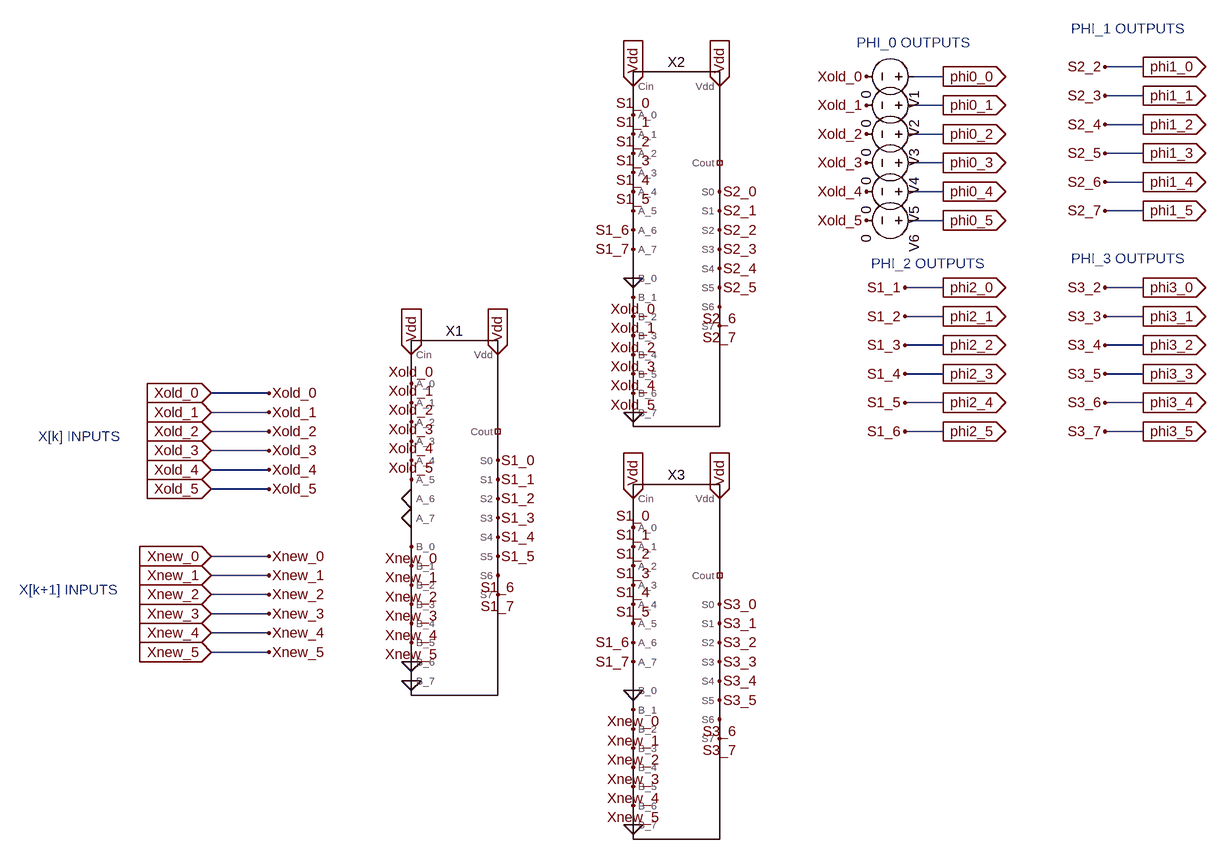
[diagram p0: schematic Draft1.asc]
Draft1.asc, the LTspice schematic file:
Version 4
SHEET 1 2044 796
WIRE 1904 -528 1840 -528
WIRE 1392 -512 1344 -512
WIRE 1904 -480 1840 -480
WIRE 1392 -464 1344 -464
WIRE 1904 -432 1840 -432
WIRE 1392 -416 1344 -416
WIRE 1904 -384 1840 -384
WIRE 1392 -368 1344 -368
WIRE 1904 -336 1840 -336
WIRE 1392 -320 1344 -320
WIRE 1904 -288 1840 -288
WIRE 1392 -272 1344 -272
WIRE 1392 -160 1328 -160
WIRE 1904 -160 1840 -160
WIRE 1392 -112 1328 -112
WIRE 1904 -112 1840 -112
WIRE 1392 -64 1328 -64
WIRE 1904 -64 1840 -64
WIRE 1392 -16 1328 -16
WIRE 1904 -16 1840 -16
WIRE -1392 16 -1488 16
WIRE 1392 32 1328 32
WIRE 1904 32 1840 32
WIRE -1392 48 -1488 48
WIRE -1392 80 -1488 80
WIRE 1392 80 1328 80
WIRE 1904 80 1840 80
WIRE -1392 112 -1488 112
WIRE -1392 144 -1488 144
WIRE -1392 176 -1488 176
WIRE -1392 288 -1488 288
WIRE -1392 320 -1488 320
WIRE -1392 352 -1488 352
WIRE -1392 384 -1488 384
WIRE -1392 416 -1488 416
WIRE -1392 448 -1488 448
FLAG -1488 16 Xold_0
IOPIN -1488 16 In
FLAG -1488 48 Xold_1
IOPIN -1488 48 In
FLAG -1488 80 Xold_2
IOPIN -1488 80 In
FLAG -1488 112 Xold_3
IOPIN -1488 112 In
FLAG -1488 144 Xold_4
IOPIN -1488 144 In
FLAG -1488 176 Xold_5
IOPIN -1488 176 In
FLAG -1488 288 Xnew_0
IOPIN -1488 288 In
FLAG -1488 320 Xnew_1
IOPIN -1488 320 In
FLAG -1488 352 Xnew_2
IOPIN -1488 352 In
FLAG -1488 384 Xnew_3
IOPIN -1488 384 In
FLAG -1488 416 Xnew_4
IOPIN -1488 416 In
FLAG -1488 448 Xnew_5
IOPIN -1488 448 In
FLAG -512 128 S1_0
FLAG -512 160 S1_1
FLAG -512 192 S1_2
FLAG -512 224 S1_3
FLAG -512 256 S1_4
FLAG -512 288 S1_5
FLAG -512 320 S1_6
FLAG -512 352 S1_7
FLAG 352 -144 Xold_0
FLAG 352 -112 Xold_1
FLAG 352 -80 Xold_2
FLAG 352 -48 Xold_3
FLAG 352 -16 Xold_4
FLAG 352 16 Xold_5
FLAG 352 544 Xnew_0
FLAG 352 576 Xnew_1
FLAG 352 608 Xnew_2
FLAG 352 640 Xnew_3
FLAG 352 672 Xnew_4
FLAG 352 704 Xnew_5
FLAG -656 192 0
FLAG -656 224 0
FLAG -656 464 0
FLAG -656 496 0
FLAG 352 48 0
FLAG 352 -176 0
FLAG 352 736 0
FLAG 352 512 0
FLAG 1392 -512 phi0_0
IOPIN 1392 -512 Out
FLAG 1392 -464 phi0_1
IOPIN 1392 -464 Out
FLAG 1392 -416 phi0_2
IOPIN 1392 -416 Out
FLAG 1392 -368 phi0_3
IOPIN 1392 -368 Out
FLAG 1392 -320 phi0_4
IOPIN 1392 -320 Out
FLAG 1392 -272 phi0_5
IOPIN 1392 -272 Out
FLAG 1904 -528 phi1_0
IOPIN 1904 -528 Out
FLAG 1904 -480 phi1_1
IOPIN 1904 -480 Out
FLAG 1904 -432 phi1_2
IOPIN 1904 -432 Out
FLAG 1904 -384 phi1_3
IOPIN 1904 -384 Out
FLAG 1904 -336 phi1_4
IOPIN 1904 -336 Out
FLAG 1904 -288 phi1_5
IOPIN 1904 -288 Out
FLAG 1904 -160 phi3_0
IOPIN 1904 -160 Out
FLAG 1904 -112 phi3_1
IOPIN 1904 -112 Out
FLAG 1904 -64 phi3_2
IOPIN 1904 -64 Out
FLAG 1904 -16 phi3_3
IOPIN 1904 -16 Out
FLAG 1904 32 phi3_4
IOPIN 1904 32 Out
FLAG 1904 80 phi3_5
IOPIN 1904 80 Out
FLAG 1392 -160 phi2_0
IOPIN 1392 -160 Out
FLAG 1392 -112 phi2_1
IOPIN 1392 -112 Out
FLAG 1392 -64 phi2_2
IOPIN 1392 -64 Out
FLAG 1392 -16 phi2_3
IOPIN 1392 -16 Out
FLAG 1392 32 phi2_4
IOPIN 1392 32 Out
FLAG 1392 80 phi2_5
IOPIN 1392 80 Out
FLAG 1264 -512 Xold_0
FLAG 1264 -464 Xold_1
FLAG 1264 -416 Xold_2
FLAG 1264 -368 Xold_3
FLAG 1264 -320 Xold_4
FLAG 1264 -272 Xold_5
FLAG 1328 -160 S1_1
FLAG 1328 -112 S1_2
FLAG 1328 -64 S1_3
FLAG 1328 -16 S1_4
FLAG 1328 32 S1_5
FLAG 1328 80 S1_6
FLAG 496 -320 S2_0
FLAG 496 -288 S2_1
FLAG 496 -256 S2_2
FLAG 496 -224 S2_3
FLAG 496 -192 S2_4
FLAG 496 -160 S2_5
FLAG 496 -128 S2_6
FLAG 496 -96 S2_7
FLAG 496 368 S3_0
FLAG 496 400 S3_1
FLAG 496 432 S3_2
FLAG 496 464 S3_3
FLAG 496 496 S3_4
FLAG 496 528 S3_5
FLAG 496 560 S3_6
FLAG 496 592 S3_7
FLAG 1840 -528 S2_2
FLAG 1840 -480 S2_3
FLAG 1840 -432 S2_4
FLAG 1840 -384 S2_5
FLAG 1840 -336 S2_6
FLAG 1840 -288 S2_7
FLAG 1840 -160 S3_2
FLAG 1840 -112 S3_3
FLAG 1840 -64 S3_4
FLAG 1840 -16 S3_5
FLAG 1840 32 S3_6
FLAG 1840 80 S3_7
FLAG 352 -448 S1_0
FLAG 352 -416 S1_1
FLAG 352 -384 S1_2
FLAG 352 -352 S1_3
FLAG 352 -320 S1_4
FLAG 352 -288 S1_5
FLAG 352 -256 S1_6
FLAG 352 -224 S1_7
FLAG 352 240 S1_0
FLAG 352 272 S1_1
FLAG 352 304 S1_2
FLAG 352 336 S1_3
FLAG 352 368 S1_4
FLAG 352 400 S1_5
FLAG 352 432 S1_6
FLAG 352 464 S1_7
FLAG -656 -48 Vdd
IOPIN -656 -48 In
FLAG -512 -48 Vdd
IOPIN -512 -48 In
FLAG 352 192 Vdd
IOPIN 352 192 In
FLAG 496 192 Vdd
IOPIN 496 192 In
FLAG 352 -496 Vdd
IOPIN 352 -496 In
FLAG 496 -496 Vdd
IOPIN 496 -496 In
FLAG -1392 16 Xold_0
FLAG -1392 80 Xold_2
FLAG -1392 112 Xold_3
FLAG -1392 144 Xold_4
FLAG -1392 176 Xold_5
FLAG -1392 288 Xnew_0
FLAG -1392 320 Xnew_1
FLAG -1392 352 Xnew_2
FLAG -1392 384 Xnew_3
FLAG -1392 416 Xnew_4
FLAG -1392 448 Xnew_5
FLAG -1392 48 Xold_1
FLAG -656 0 Xold_0
FLAG -656 64 Xold_2
FLAG -656 96 Xold_3
FLAG -656 128 Xold_4
FLAG -656 160 Xold_5
FLAG -656 32 Xold_1
FLAG -656 272 Xnew_0
FLAG -656 304 Xnew_1
FLAG -656 336 Xnew_2
FLAG -656 368 Xnew_3
FLAG -656 400 Xnew_4
FLAG -656 432 Xnew_5
SYMBOL voltage 1360 -512 R90
WINDOW 123 0 0 Left 0
WINDOW 39 0 0 Left 0
SYMATTR InstName V1
SYMATTR Value 0
SYMBOL voltage 1360 -464 R90
WINDOW 123 0 0 Left 0
WINDOW 39 0 0 Left 0
SYMATTR InstName V2
SYMATTR Value 0
SYMBOL voltage 1360 -416 R90
WINDOW 123 0 0 Left 0
WINDOW 39 0 0 Left 0
SYMATTR InstName V3
SYMATTR Value 0
SYMBOL voltage 1360 -368 R90
WINDOW 123 0 0 Left 0
WINDOW 39 0 0 Left 0
SYMATTR InstName V4
SYMATTR Value 0
SYMBOL voltage 1360 -320 R90
WINDOW 123 0 0 Left 0
WINDOW 39 0 0 Left 0
SYMATTR InstName V5
SYMATTR Value 0
SYMBOL voltage 1360 -272 R90
WINDOW 123 0 0 Left 0
WINDOW 39 0 0 Left 0
SYMATTR InstName V6
SYMATTR Value 0
SYMBOL CLA-8bit -592 224 R0
SYMATTR InstName X1
SYMBOL CLA-8bit 416 -224 R0
SYMATTR InstName X2
SYMBOL CLA-8bit 416 464 R0
SYMATTR InstName X3
TEXT 1248 -568 Left 2 ;PHI_0 OUTPUTS
TEXT 1784 -592 Left 2 ;PHI_1 OUTPUTS
TEXT 1784 -208 Left 2 ;PHI_3 OUTPUTS
TEXT 1272 -200 Left 2 ;PHI_2 OUTPUTS
TEXT -1776 88 Left 2 ;X[k] INPUTS
TEXT -1808 344 Left 2 ;X[k+1] INPUTS

The netlist it stands for:
* Draft1.asc
V1 phi0_0 Xold_0 0
V2 phi0_1 Xold_1 0
V3 phi0_2 Xold_2 0
V4 phi0_3 Xold_3 0
V5 phi0_4 Xold_4 0
V6 phi0_5 Xold_5 0
XX1 Xold_0 Xold_1 Xold_2 Xold_3 Xold_4 Xold_5 0 0 Xnew_0 Xnew_1 Xnew_2 Xnew_3 Xnew_4 Xnew_5 0 0 Vdd Vdd NC_01 S1_0 phi2_0 phi2_1 phi2_2 phi2_3 phi2_4 phi2_5 S1_7 CLA-8bit  ; pins A_0 A_1 A_2 A_3 A_4 A_5 A_6 A_7 B_0 B_1 B_2 B_3 B_4 B_5 B_6 B_7 Cin Vdd Cout S0 S1 S2 S3 S4 S5 S6 S7
XX2 S1_0 phi2_0 phi2_1 phi2_2 phi2_3 phi2_4 phi2_5 S1_7 0 Xold_0 Xold_1 Xold_2 Xold_3 Xold_4 Xold_5 0 Vdd Vdd NC_02 S2_0 S2_1 S2_2 S2_3 S2_4 S2_5 S2_6 S2_7 CLA-8bit  ; pins A_0 A_1 A_2 A_3 A_4 A_5 A_6 A_7 B_0 B_1 B_2 B_3 B_4 B_5 B_6 B_7 Cin Vdd Cout S0 S1 S2 S3 S4 S5 S6 S7
XX3 S1_0 phi2_0 phi2_1 phi2_2 phi2_3 phi2_4 phi2_5 S1_7 0 Xnew_0 Xnew_1 Xnew_2 Xnew_3 Xnew_4 Xnew_5 0 Vdd Vdd NC_03 S3_0 S3_1 S3_2 S3_3 S3_4 S3_5 S3_6 S3_7 CLA-8bit  ; pins A_0 A_1 A_2 A_3 A_4 A_5 A_6 A_7 B_0 B_1 B_2 B_3 B_4 B_5 B_6 B_7 Cin Vdd Cout S0 S1 S2 S3 S4 S5 S6 S7
* PHI_0 OUTPUTS
* PHI_1 OUTPUTS
* PHI_3 OUTPUTS
* PHI_2 OUTPUTS
* X[k] INPUTS
* X[k+1] INPUTS
.backanno
.end